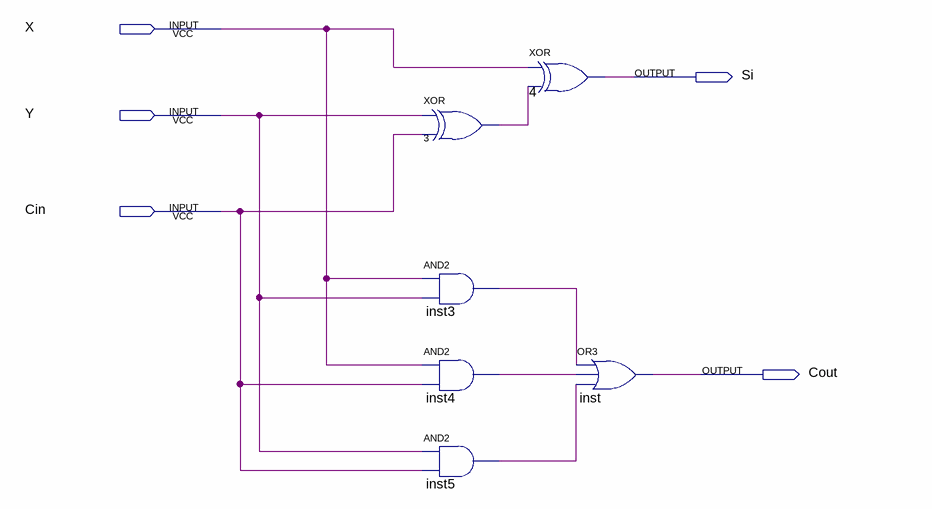
[diagram p0: schematic sheet]
// Quartus schematic Block2.bdf as structural Verilog: 6 symbols, 5 pins
module Block2 (
  input  X,
  input  Y,
  input  Cin,
  output Si,
  output Cout
);

  wire inst3_out, inst4_out, inst5_out, n3_out;

  xor u_3 (n3_out, Y, Cin);
  and inst3 (inst3_out, X, Y);
  and inst4 (inst4_out, X, Cin);
  and inst5 (inst5_out, Y, Cin);
  xor u_4 (Si, X, n3_out);
  or inst (Cout, inst3_out, inst4_out, inst5_out);
endmodule
